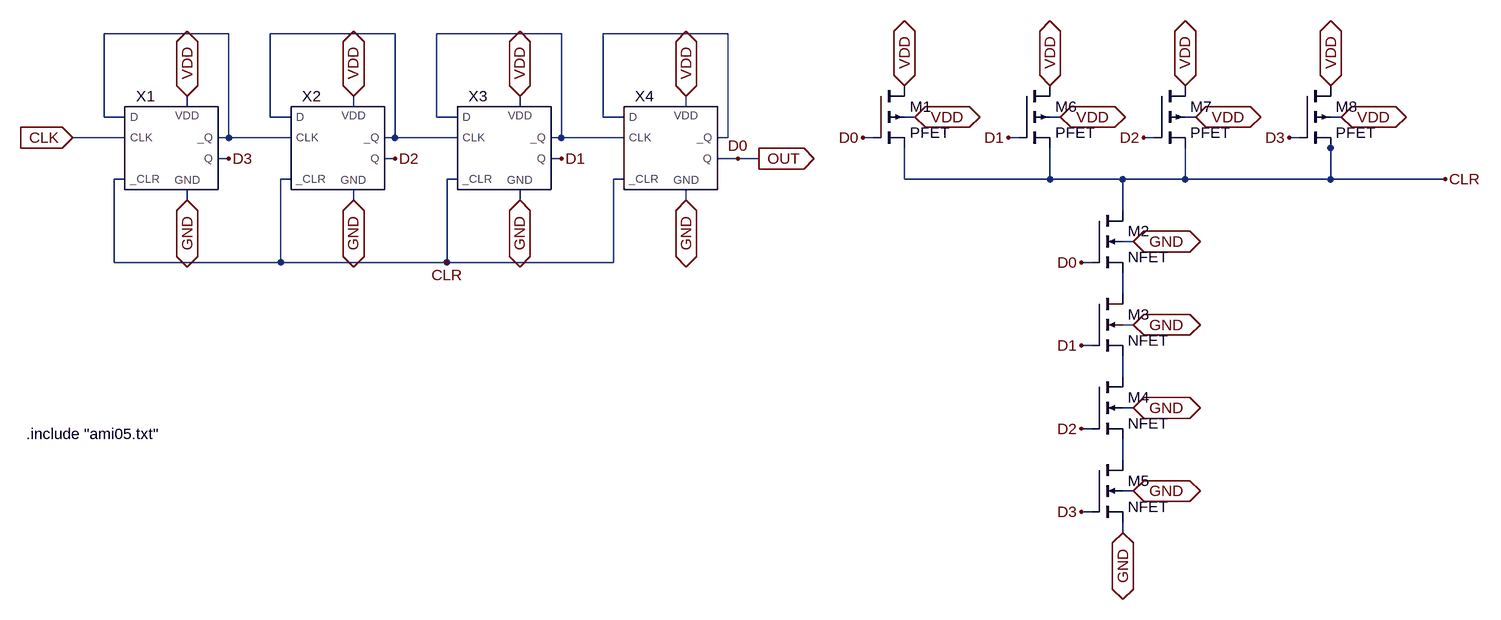
[diagram p0: schematic divisor.asc]
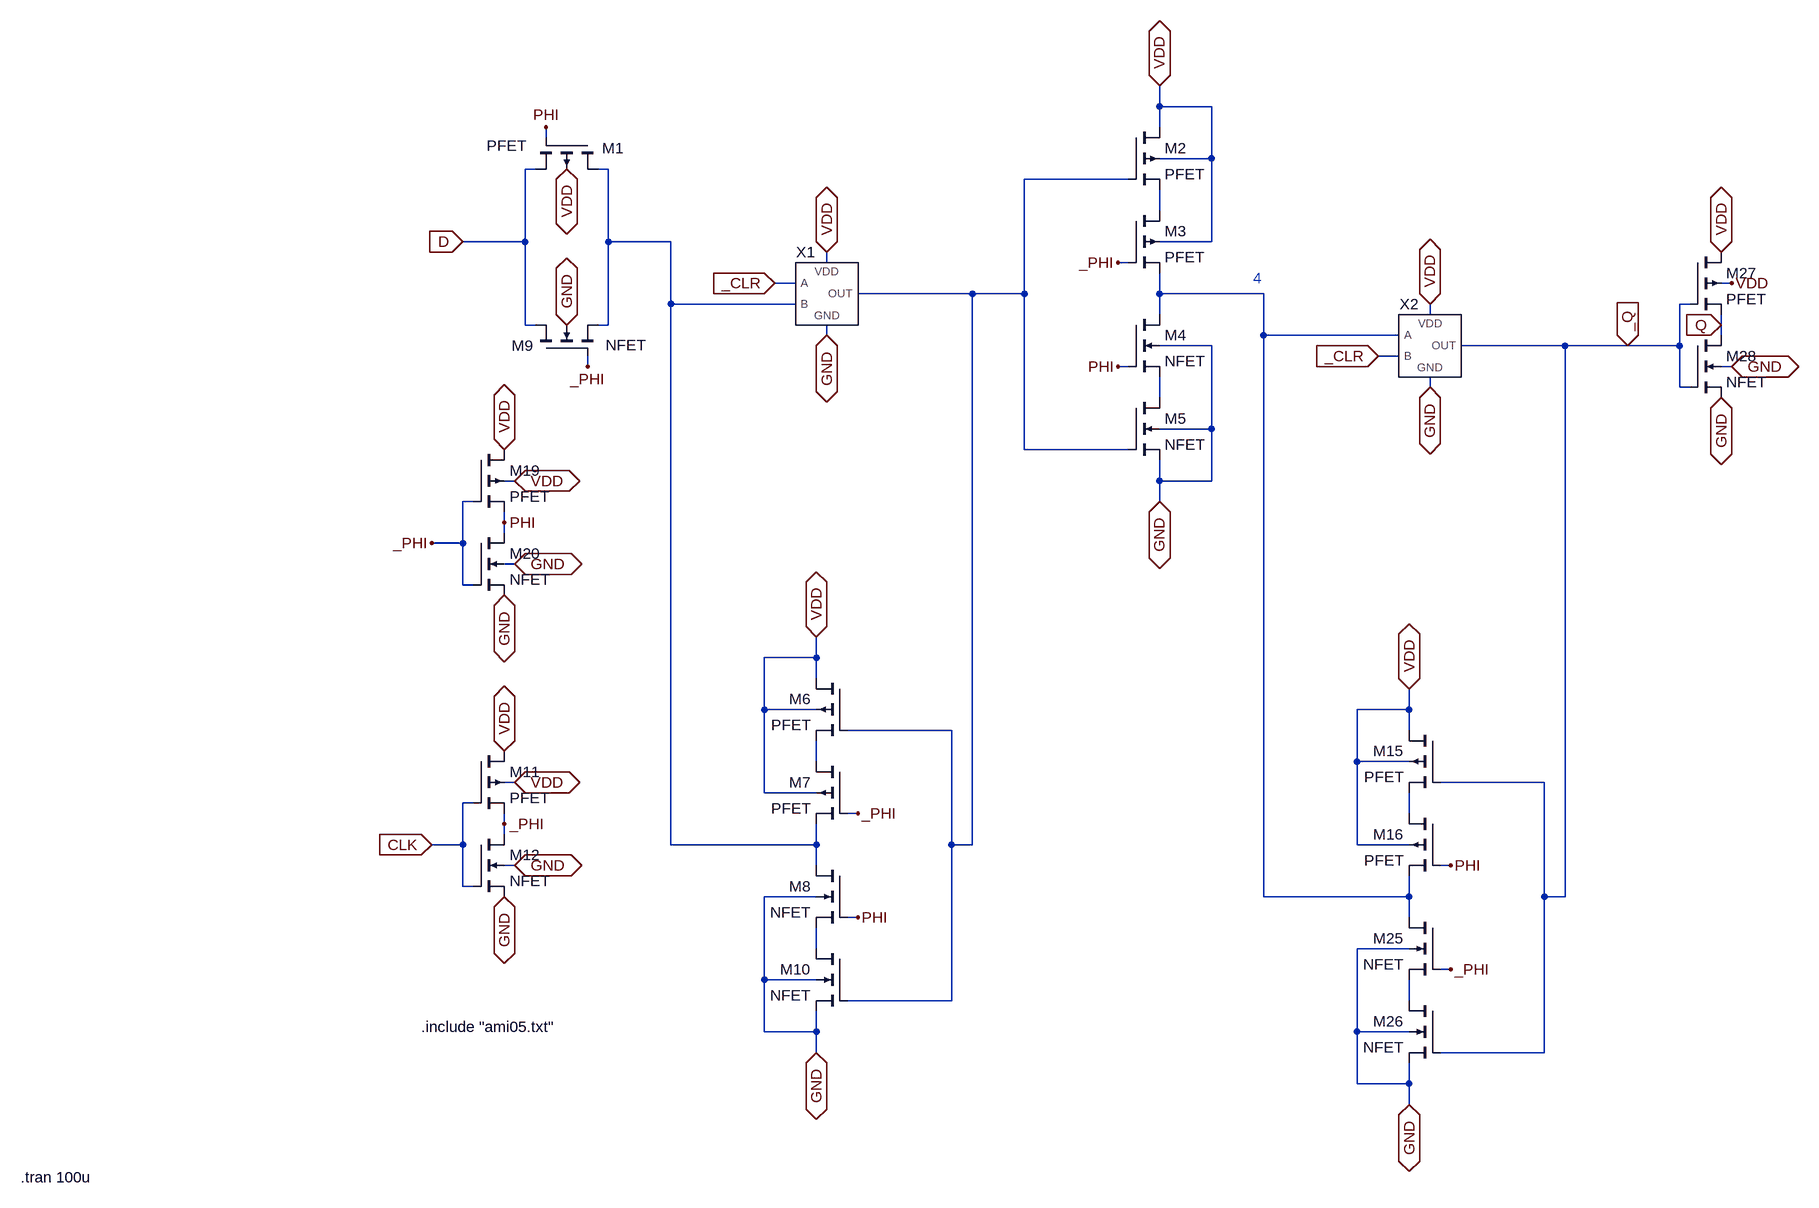
[diagram p1: sub-circuit ffd.asc]
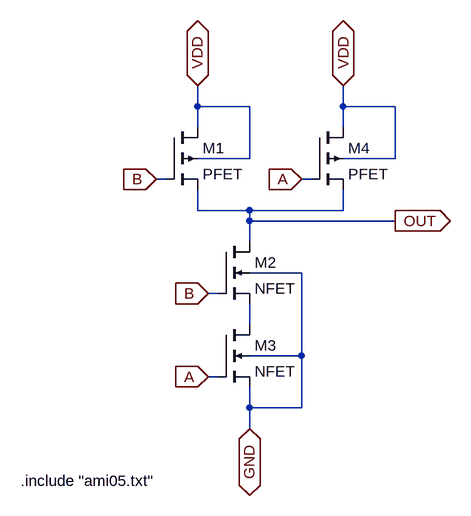
[diagram p2: sub-circuit nand.asc]
divisor.asc, the LTspice schematic file:
Version 4
SHEET 1 2576 1504
WIRE 192 -16 0 -16
WIRE 448 -16 256 -16
WIRE 704 -16 512 -16
WIRE 960 -16 768 -16
WIRE 128 96 128 80
WIRE 384 96 384 80
WIRE 640 96 640 80
WIRE 896 96 896 80
WIRE 0 112 0 -16
WIRE 32 112 0 112
WIRE 256 112 256 -16
WIRE 288 112 256 112
WIRE 512 112 512 -16
WIRE 544 112 512 112
WIRE 768 112 768 -16
WIRE 800 112 768 112
WIRE 1248 112 1232 112
WIRE 1472 112 1456 112
WIRE 1680 112 1664 112
WIRE 1904 112 1888 112
WIRE 32 144 -48 144
WIRE 192 144 192 -16
WIRE 192 144 176 144
WIRE 288 144 192 144
WIRE 448 144 448 -16
WIRE 448 144 432 144
WIRE 544 144 448 144
WIRE 704 144 704 -16
WIRE 704 144 688 144
WIRE 800 144 704 144
WIRE 960 144 960 -16
WIRE 960 144 944 144
WIRE 1184 144 1168 144
WIRE 1408 144 1392 144
WIRE 1616 144 1600 144
WIRE 1840 144 1824 144
WIRE 1888 160 1888 144
WIRE 192 176 176 176
WIRE 448 176 432 176
WIRE 704 176 688 176
WIRE 976 176 944 176
WIRE 1008 176 976 176
WIRE 32 208 16 208
WIRE 288 208 272 208
WIRE 544 208 528 208
WIRE 800 208 784 208
WIRE 1232 208 1232 160
WIRE 1456 208 1456 160
WIRE 1456 208 1232 208
WIRE 1568 208 1456 208
WIRE 1664 208 1664 160
WIRE 1664 208 1568 208
WIRE 1888 208 1888 160
WIRE 1888 208 1664 208
WIRE 2064 208 1888 208
WIRE 128 240 128 224
WIRE 384 240 384 224
WIRE 640 240 640 224
WIRE 896 240 896 224
WIRE 1568 256 1568 208
WIRE 1584 304 1568 304
WIRE 16 336 16 208
WIRE 272 336 272 208
WIRE 272 336 16 336
WIRE 528 336 528 208
WIRE 528 336 272 336
WIRE 784 336 784 208
WIRE 784 336 528 336
WIRE 1520 336 1504 336
WIRE 1568 384 1568 352
WIRE 1584 432 1568 432
WIRE 1520 464 1504 464
WIRE 1568 512 1568 480
WIRE 1584 560 1568 560
WIRE 1520 592 1504 592
WIRE 1568 640 1568 608
WIRE 1584 688 1568 688
WIRE 1520 720 1504 720
WIRE 1568 752 1568 736
FLAG 128 80 VDD
IOPIN 128 80 BiDir
FLAG 128 240 GND
IOPIN 128 240 BiDir
FLAG -48 144 CLK
IOPIN -48 144 In
FLAG 384 80 VDD
IOPIN 384 80 BiDir
FLAG 384 240 GND
IOPIN 384 240 BiDir
FLAG 640 80 VDD
IOPIN 640 80 BiDir
FLAG 640 240 GND
IOPIN 640 240 BiDir
FLAG 896 80 VDD
IOPIN 896 80 BiDir
FLAG 896 240 GND
IOPIN 896 240 BiDir
FLAG 1008 176 OUT
IOPIN 1008 176 Out
FLAG 528 336 CLR
FLAG 976 176 D0
FLAG 704 176 D1
FLAG 448 176 D2
FLAG 192 176 D3
FLAG 1248 112 VDD
IOPIN 1248 112 BiDir
FLAG 1584 304 GND
IOPIN 1584 304 BiDir
FLAG 1232 64 VDD
IOPIN 1232 64 BiDir
FLAG 1584 432 GND
IOPIN 1584 432 BiDir
FLAG 1584 560 GND
IOPIN 1584 560 BiDir
FLAG 1584 688 GND
IOPIN 1584 688 BiDir
FLAG 1568 752 GND
IOPIN 1568 752 BiDir
FLAG 1472 112 VDD
IOPIN 1472 112 BiDir
FLAG 1456 64 VDD
IOPIN 1456 64 BiDir
FLAG 1680 112 VDD
IOPIN 1680 112 BiDir
FLAG 1664 64 VDD
IOPIN 1664 64 BiDir
FLAG 1904 112 VDD
IOPIN 1904 112 BiDir
FLAG 1888 64 VDD
IOPIN 1888 64 BiDir
FLAG 1168 144 D0
FLAG 1392 144 D1
FLAG 1600 144 D2
FLAG 1824 144 D3
FLAG 1504 336 D0
FLAG 1504 464 D1
FLAG 1504 592 D2
FLAG 1504 720 D3
FLAG 2064 208 CLR
SYMBOL FFD 112 176 R0
SYMATTR InstName X1
SYMBOL FFD 368 176 R0
SYMATTR InstName X2
SYMBOL FFD 624 176 R0
SYMATTR InstName X3
SYMBOL FFD 880 176 R0
SYMATTR InstName X4
SYMBOL pmos4 1184 64 R0
SYMATTR InstName M1
SYMATTR Value2 l=600n w=3u
SYMATTR Value PFET
SYMBOL nmos4 1520 256 R0
SYMATTR InstName M2
SYMATTR Value2 l=600n w=12u
SYMATTR Value NFET
SYMBOL nmos4 1520 384 R0
SYMATTR InstName M3
SYMATTR Value2 l=600n w=12u
SYMATTR Value NFET
SYMBOL nmos4 1520 512 R0
SYMATTR InstName M4
SYMATTR Value2 l=600n w=12u
SYMATTR Value NFET
SYMBOL nmos4 1520 640 R0
SYMATTR InstName M5
SYMATTR Value2 l=600n w=12u
SYMATTR Value NFET
SYMBOL pmos4 1408 64 R0
SYMATTR InstName M6
SYMATTR Value2 l=600n w=3u
SYMATTR Value PFET
SYMBOL pmos4 1616 64 R0
SYMATTR InstName M7
SYMATTR Value2 l=600n w=3u
SYMATTR Value PFET
SYMBOL pmos4 1840 64 R0
SYMATTR InstName M8
SYMATTR Value2 l=600n w=3u
SYMATTR Value PFET
TEXT -120 600 Left 2 !.include "ami05.txt"

ffd.asc, the sub-circuit schematic file:
Version 4
SHEET 1 2988 1332
WIRE 992 -336 992 -368
WIRE 1072 -336 992 -336
WIRE 992 -304 992 -336
WIRE 48 -288 48 -304
WIRE 1072 -256 1072 -336
WIRE 1072 -256 992 -256
WIRE 32 -240 16 -240
WIRE 144 -240 128 -240
WIRE 944 -224 784 -224
WIRE 992 -176 992 -208
WIRE 16 -128 16 -240
WIRE 16 -128 -80 -128
WIRE 144 -128 144 -240
WIRE 240 -128 144 -128
WIRE 1072 -128 1072 -256
WIRE 1072 -128 992 -128
WIRE 480 -96 480 -112
WIRE 944 -96 928 -96
WIRE 432 -64 400 -64
WIRE 1872 -64 1856 -64
WIRE 704 -48 528 -48
WIRE 784 -48 784 -224
WIRE 784 -48 704 -48
WIRE 992 -48 992 -80
WIRE 1152 -48 992 -48
WIRE 240 -32 240 -128
WIRE 432 -32 240 -32
WIRE 1808 -32 1792 -32
WIRE 992 -16 992 -48
WIRE 1408 -16 1408 -32
WIRE 16 0 16 -128
WIRE 32 0 16 0
WIRE 144 0 144 -128
WIRE 144 0 128 0
WIRE 1856 0 1856 -16
WIRE 480 16 480 0
WIRE 1152 16 1152 -48
WIRE 1360 16 1152 16
WIRE 1856 16 1856 0
WIRE 1072 32 992 32
WIRE 1616 32 1456 32
WIRE 1712 32 1616 32
WIRE 1792 32 1792 -32
WIRE 1792 32 1712 32
WIRE 1360 48 1328 48
WIRE 112 64 112 48
WIRE 944 64 928 64
WIRE 1872 64 1856 64
WIRE 1408 96 1408 80
WIRE 1792 96 1792 32
WIRE 1808 96 1792 96
WIRE 992 112 992 80
WIRE 1072 160 1072 32
WIRE 1072 160 992 160
WIRE 784 192 784 -48
WIRE 944 192 784 192
WIRE 0 240 -16 240
WIRE 992 240 992 208
WIRE 1072 240 1072 160
WIRE 1072 240 992 240
WIRE -64 272 -80 272
WIRE 992 272 992 240
WIRE -16 304 -16 288
WIRE -16 320 -16 304
WIRE -80 336 -80 272
WIRE -80 336 -128 336
WIRE 0 368 -16 368
WIRE -80 400 -80 336
WIRE -64 400 -80 400
WIRE 464 512 464 480
WIRE 464 512 384 512
WIRE 464 544 464 512
WIRE 384 592 384 512
WIRE 464 592 384 592
WIRE 1376 592 1376 560
WIRE 1376 592 1296 592
WIRE 672 624 512 624
WIRE 1376 624 1376 592
WIRE 464 672 464 640
WIRE 1296 672 1296 592
WIRE 1376 672 1296 672
WIRE 0 704 -16 704
WIRE 1584 704 1424 704
WIRE 384 720 384 592
WIRE 464 720 384 720
WIRE -64 736 -80 736
WIRE 528 752 512 752
WIRE 1376 752 1376 720
WIRE -16 768 -16 752
WIRE -16 784 -16 768
WIRE -80 800 -80 736
WIRE -80 800 -128 800
WIRE 240 800 240 -32
WIRE 464 800 464 768
WIRE 464 800 240 800
WIRE 672 800 672 624
WIRE 704 800 704 -48
WIRE 704 800 672 800
WIRE 1296 800 1296 672
WIRE 1376 800 1296 800
WIRE 0 832 -16 832
WIRE 464 832 464 800
WIRE 1440 832 1424 832
WIRE -80 864 -80 800
WIRE -64 864 -80 864
WIRE 464 880 384 880
WIRE 1152 880 1152 16
WIRE 1376 880 1376 848
WIRE 1376 880 1152 880
WIRE 1584 880 1584 704
WIRE 1616 880 1616 32
WIRE 1616 880 1584 880
WIRE 528 912 512 912
WIRE 1376 912 1376 880
WIRE 464 960 464 928
WIRE 1376 960 1296 960
WIRE 1440 992 1424 992
WIRE 384 1008 384 880
WIRE 464 1008 384 1008
WIRE 672 1040 672 800
WIRE 672 1040 512 1040
WIRE 1376 1040 1376 1008
WIRE 384 1088 384 1008
WIRE 464 1088 464 1056
WIRE 464 1088 384 1088
WIRE 1296 1088 1296 960
WIRE 1376 1088 1296 1088
WIRE 464 1120 464 1088
WIRE 1584 1120 1584 880
WIRE 1584 1120 1424 1120
WIRE 1296 1168 1296 1088
WIRE 1376 1168 1376 1136
WIRE 1376 1168 1296 1168
WIRE 1376 1200 1376 1168
FLAG 80 -240 VDD
IOPIN 80 -240 BiDir
FLAG 48 -304 PHI
FLAG 112 64 _PHI
FLAG -80 -128 D
IOPIN -80 -128 In
FLAG 0 704 VDD
IOPIN 0 704 BiDir
FLAG -16 768 _PHI
FLAG -128 800 CLK
IOPIN -128 800 In
FLAG -16 880 GND
IOPIN -16 880 BiDir
FLAG 0 832 GND
IOPIN 0 832 BiDir
FLAG 80 0 GND
IOPIN 80 0 BiDir
FLAG 0 240 VDD
IOPIN 0 240 BiDir
FLAG -16 304 PHI
FLAG -128 336 _PHI
FLAG -16 416 GND
IOPIN -16 416 BiDir
FLAG 0 368 GND
IOPIN 0 368 BiDir
FLAG -16 192 VDD
IOPIN -16 192 BiDir
FLAG -16 656 VDD
IOPIN -16 656 BiDir
FLAG 992 -368 VDD
IOPIN 992 -368 BiDir
FLAG 992 272 GND
IOPIN 992 272 BiDir
FLAG 928 -96 _PHI
FLAG 928 64 PHI
FLAG 464 480 VDD
IOPIN 464 480 BiDir
FLAG 464 1120 GND
IOPIN 464 1120 BiDir
FLAG 528 752 _PHI
FLAG 528 912 PHI
FLAG 1376 560 VDD
IOPIN 1376 560 BiDir
FLAG 1376 1200 GND
IOPIN 1376 1200 BiDir
FLAG 1440 832 PHI
FLAG 1440 992 _PHI
FLAG 1872 -64 VDD
FLAG 1856 0 Q
IOPIN 1856 0 In
FLAG 1856 112 GND
IOPIN 1856 112 BiDir
FLAG 1872 64 GND
IOPIN 1872 64 BiDir
FLAG 1856 -112 VDD
IOPIN 1856 -112 BiDir
FLAG 1712 32 _Q
IOPIN 1712 32 In
FLAG 480 16 GND
IOPIN 480 16 BiDir
FLAG 1408 96 GND
IOPIN 1408 96 BiDir
FLAG 1408 -32 VDD
IOPIN 1408 -32 BiDir
FLAG 480 -112 VDD
IOPIN 480 -112 BiDir
FLAG 400 -64 _CLR
IOPIN 400 -64 In
FLAG 1328 48 _CLR
IOPIN 1328 48 In
SYMBOL pmos4 128 -288 R90
WINDOW 0 16 -40 VRight 2
WINDOW 3 12 110 VRight 2
SYMATTR InstName M1
SYMATTR Value PFET
SYMATTR Value2 l=600n w=6u
SYMBOL nmos4 32 48 R270
WINDOW 0 16 -37 VRight 2
WINDOW 3 17 108 VRight 2
SYMATTR InstName M9
SYMATTR Value NFET
SYMATTR Value2 l=600n w=3u
SYMBOL pmos4 -64 192 R0
SYMATTR InstName M19
SYMATTR Value2 l=600n w=3u
SYMATTR Value PFET
SYMBOL nmos4 -64 320 R0
SYMATTR InstName M20
SYMATTR Value2 l=600n w=1.5u
SYMATTR Value NFET
SYMBOL pmos4 944 -304 R0
SYMATTR InstName M2
SYMATTR Value2 l=600n w=6u
SYMATTR Value PFET
SYMBOL pmos4 944 -176 R0
SYMATTR InstName M3
SYMATTR Value2 l=600n w=6u
SYMATTR Value PFET
SYMBOL nmos4 944 -16 R0
SYMATTR InstName M4
SYMATTR Value2 l=600n w=3u
SYMATTR Value NFET
SYMBOL nmos4 944 112 R0
SYMATTR InstName M5
SYMATTR Value2 l=600n w=3u
SYMATTR Value NFET
SYMBOL pmos4 512 544 M0
SYMATTR InstName M6
SYMATTR Value2 l=600n w=6u
SYMATTR Value PFET
SYMBOL pmos4 512 672 M0
SYMATTR InstName M7
SYMATTR Value2 l=600n w=6u
SYMATTR Value PFET
SYMBOL nmos4 512 832 M0
SYMATTR InstName M8
SYMATTR Value2 l=600n w=3u
SYMATTR Value NFET
SYMBOL nmos4 512 960 M0
SYMATTR InstName M10
SYMATTR Value2 l=600n w=3u
SYMATTR Value NFET
SYMBOL pmos4 1424 624 M0
SYMATTR InstName M15
SYMATTR Value2 l=600n w=6u
SYMATTR Value PFET
SYMBOL pmos4 1424 752 M0
SYMATTR InstName M16
SYMATTR Value2 l=600n w=6u
SYMATTR Value PFET
SYMBOL nmos4 1424 912 M0
SYMATTR InstName M25
SYMATTR Value2 l=600n w=3u
SYMATTR Value NFET
SYMBOL nmos4 1424 1040 M0
SYMATTR InstName M26
SYMATTR Value2 l=600n w=3u
SYMATTR Value NFET
SYMBOL pmos4 1808 -112 R0
SYMATTR InstName M27
SYMATTR Value2 l=600n w=3u
SYMATTR Value PFET
SYMBOL nmos4 1808 16 R0
SYMATTR InstName M28
SYMATTR Value2 l=600n w=1.5u
SYMATTR Value NFET
SYMBOL NAND 480 -48 R0
SYMATTR InstName X1
SYMBOL NAND 1408 32 R0
SYMATTR InstName X2
SYMBOL pmos4 -64 656 R0
SYMATTR InstName M11
SYMATTR Value2 l=600n w=3u
SYMATTR Value PFET
SYMBOL nmos4 -64 784 R0
SYMATTR InstName M12
SYMATTR Value2 l=600n w=1.5u
SYMATTR Value NFET
TEXT -144 1080 Left 2 !.include "ami05.txt"
TEXT -760 1312 Left 2 !.tran 100u
TEXT 1136 -72 Left 2 ;4

nand.asc, the sub-circuit schematic file:
Version 4
SHEET 1 880 680
WIRE 32 -96 32 -128
WIRE 112 -96 32 -96
WIRE 256 -96 256 -128
WIRE 336 -96 256 -96
WIRE 32 -64 32 -96
WIRE 256 -64 256 -96
WIRE 112 -16 112 -96
WIRE 112 -16 32 -16
WIRE 336 -16 336 -96
WIRE 336 -16 256 -16
WIRE -16 16 -32 16
WIRE 208 16 192 16
WIRE 32 64 32 32
WIRE 112 64 32 64
WIRE 256 64 256 32
WIRE 256 64 112 64
WIRE 112 80 112 64
WIRE 336 80 112 80
WIRE 112 112 112 80
WIRE 192 160 112 160
WIRE 64 192 48 192
WIRE 112 240 112 208
WIRE 192 288 192 160
WIRE 192 288 112 288
WIRE 64 320 48 320
WIRE 112 368 112 336
WIRE 192 368 192 288
WIRE 192 368 112 368
WIRE 112 400 112 368
FLAG 112 400 GND
IOPIN 112 400 BiDir
FLAG 32 -128 VDD
IOPIN 32 -128 BiDir
FLAG 256 -128 VDD
IOPIN 256 -128 BiDir
FLAG 192 16 A
IOPIN 192 16 In
FLAG 48 320 A
IOPIN 48 320 In
FLAG 48 192 B
IOPIN 48 192 In
FLAG -32 16 B
IOPIN -32 16 In
FLAG 336 80 OUT
IOPIN 336 80 Out
SYMBOL pmos4 -16 -64 R0
SYMATTR InstName M1
SYMATTR Value2 l=600n w=3u
SYMATTR Value PFET
SYMBOL nmos4 64 112 R0
SYMATTR InstName M2
SYMATTR Value2 l=600n w=3u
SYMATTR Value NFET
SYMBOL nmos4 64 240 R0
SYMATTR InstName M3
SYMATTR Value2 l=600n w=3u
SYMATTR Value NFET
SYMBOL pmos4 208 -64 R0
SYMATTR InstName M4
SYMATTR Value2 l=600n w=3u
SYMATTR Value PFET
TEXT -240 480 Left 2 !.include "ami05.txt"

The netlist it stands for:
* divisor.asc
XX1 CLR CLK N001 D3 N001 GND VDD ffd
XX2 CLR N001 N002 D2 N002 GND VDD ffd
XX3 CLR N002 N003 D1 N003 GND VDD ffd
XX4 CLR N003 N004 D0 N004 GND VDD ffd
M1 VDD D0 CLR VDD PFET l=600n w=3u
M2 CLR D0 N005 GND NFET l=600n w=12u
M3 N005 D1 N006 GND NFET l=600n w=12u
M4 N006 D2 N007 GND NFET l=600n w=12u
M5 N007 D3 GND GND NFET l=600n w=12u
M6 VDD D1 CLR VDD PFET l=600n w=3u
M7 VDD D2 CLR VDD PFET l=600n w=3u
M8 VDD D3 CLR VDD PFET l=600n w=3u

* block symbol definitions
.subckt ffd _CLR CLK D Q _Q GND VDD
M1 N001 PHI D VDD PFET l=600n w=6u
M9 D _PHI N001 GND NFET l=600n w=3u
M19 VDD _PHI PHI VDD PFET l=600n w=3u
M20 PHI _PHI GND GND NFET l=600n w=1.5u
M2 VDD N002 N003 VDD PFET l=600n w=6u
M3 N003 _PHI N004 VDD PFET l=600n w=6u
M4 N004 PHI N005 GND NFET l=600n w=3u
M5 N005 N002 GND GND NFET l=600n w=3u
M6 VDD N002 N006 VDD PFET l=600n w=6u
M7 N006 _PHI N001 VDD PFET l=600n w=6u
M8 N001 PHI N008 GND NFET l=600n w=3u
M10 N008 N002 GND GND NFET l=600n w=3u
M15 VDD _Q N007 VDD PFET l=600n w=6u
M16 N007 PHI N004 VDD PFET l=600n w=6u
M25 N004 _PHI N009 GND NFET l=600n w=3u
M26 N009 _Q GND GND NFET l=600n w=3u
M27 VDD _Q Q VDD PFET l=600n w=3u
M28 Q _Q GND GND NFET l=600n w=1.5u
XX1 _CLR N001 GND N002 VDD nand
XX2 N004 _CLR GND _Q VDD nand
M11 VDD CLK _PHI VDD PFET l=600n w=3u
M12 _PHI CLK GND GND NFET l=600n w=1.5u
.include "ami05.txt"
.tran 100u
* 4
.ends ffd

.subckt nand A B GND OUT VDD
M1 VDD B OUT VDD PFET l=600n w=3u
M2 OUT B N001 GND NFET l=600n w=3u
M3 N001 A GND GND NFET l=600n w=3u
M4 VDD A OUT VDD PFET l=600n w=3u
.include "ami05.txt"
.ends nand

.model NMOS NMOS
.model PMOS PMOS
.lib standard.mos
.include "ami05.txt"
.backanno
.end